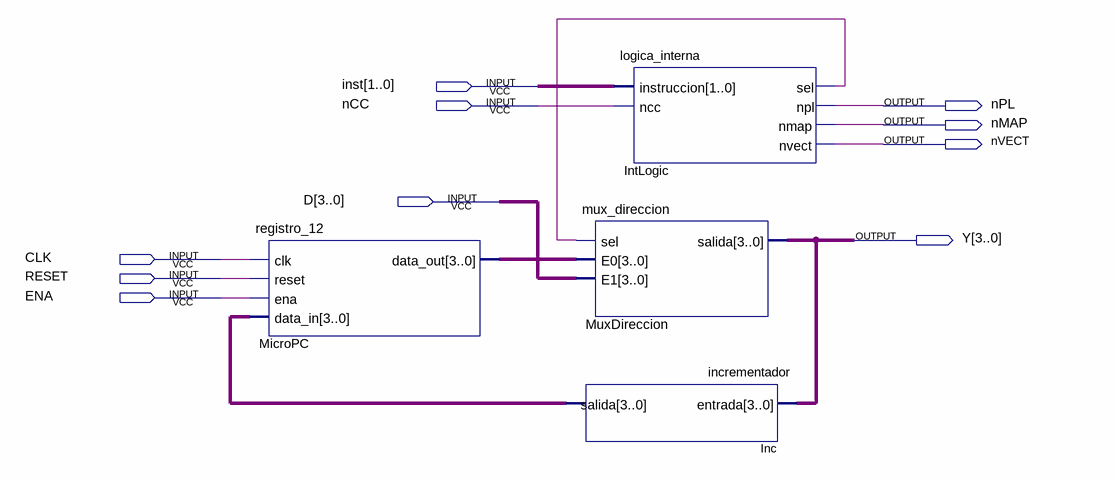
[diagram p0: schematic sheet]
// Quartus schematic practica06.bdf as structural Verilog: 4 symbols, 10 pins
module practica06 (
  input  [1:0] inst,
  input  nCC,
  input  [3:0] D,
  input  CLK,
  input  RESET,
  input  ENA,
  output nPL,
  output nMAP,
  output nVECT,
  output [3:0] Y
);

  wire IntLogic_sel;
  wire [3:0] Inc_salida, MicroPC_data_out;

  registro_12 MicroPC (.clk(CLK), .reset(RESET), .ena(ENA), .data_in(Inc_salida), .data_out(MicroPC_data_out));
  mux_direccion MuxDireccion (.sel(IntLogic_sel), .E0(MicroPC_data_out), .E1(D), .salida(Y));
  incrementador Inc (.entrada(Y), .salida(Inc_salida));
  logica_interna IntLogic (.instruccion(inst), .ncc(nCC), .sel(IntLogic_sel), .npl(nPL), .nmap(nMAP), .nvect(nVECT));
endmodule
